# Altium project Forninho.PrjPcb
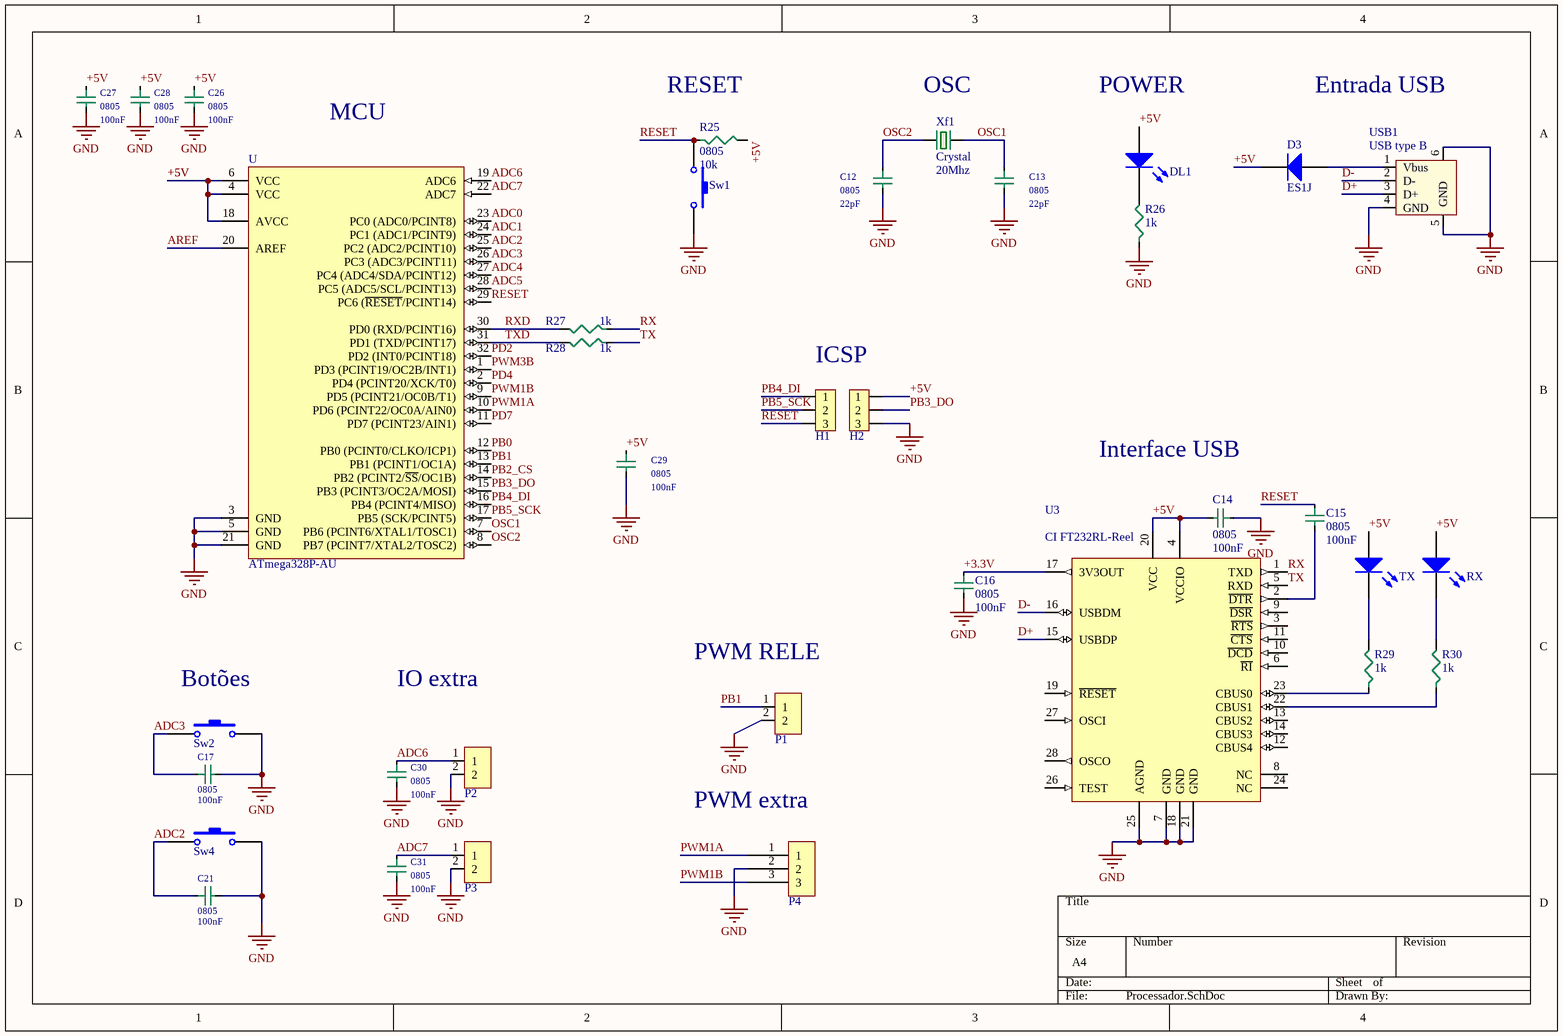
[diagram p0: Processador.SchDoc]
2 sheets, 84 parts. Net scope: global (net labels, ports and power ports of the same name join across sheets).
Board file: PCB.PcbDoc
Sheets:
  Processador.SchDoc
  instrumentacao.SchDoc

## Sheet Processador.SchDoc
size A4

### Parts
(Parts that share a designator on the sheet are numbered #1, #2 ... from top to bottom, then left to right.)
C12  0805  value 22pF  [0805C]
C13  0805  value 22pF  [0805C]
C14  0805  value 100nF  [0805C]
C15  0805  value 100nF  [0805C]
C16  0805  value 100nF  [0805C]
C17  0805  value 100nF  [0805C]
C21  0805  value 100nF  [0805C]
C26  0805  value 100nF  [0805C]
C27  0805  value 100nF  [0805C]
C28  0805  value 100nF  [0805C]
C29  0805  value 100nF  [0805C]
C30  0805  value 100nF  [0805C]
C31  0805  value 100nF  [0805C]
D3  ES1J  [DO-214AC]
DL1  LED 0805  [LED SMD 0805]  (value not drawn)
H1#1  Header 3 pins  [Header 3]  (value not drawn)
H2  Header 3 pins  [Header 3]  (value not drawn)
P1  Molex_2  [Molex_2]  (value not drawn)
P2  Molex_2  [Molex_2]  (value not drawn)
P3  Molex_2  [Molex_2]  (value not drawn)
P4  Molex_3  [Molex_3]  (value not drawn)
R25  0805  value 10k  [0805]
R26  value 1k  [0805]  (hidden comment: 0805)
R27  value 1k  [0805]  (hidden comment: 0805)
R28  value 1k  [0805]  (hidden comment: 0805)
R29  value 1k  [0805]  (hidden comment: 0805)
R30  value 1k  [0805]  (hidden comment: 0805)
RX  LED 0805  [LED SMD 0805]  (value not drawn)
Sw1  SW_PUSH_BUTTON  [PUSH_BUTTON]  (value not drawn)
Sw2  SW_PUSH_BUTTON  [PUSH_BUTTON]  (value not drawn)
Sw4  SW_PUSH_BUTTON  [PUSH_BUTTON]  (value not drawn)
TX  LED 0805  [LED SMD 0805]  (value not drawn)
U  ATmega328P-AU  [32A_N]
U3  CI FT232RL-Reel  [SSOP-28_N]
USB1  USB type B  [USB2.5-2H4D]
Xf1  Crystal  [CRYSTAL HIGH]

### Nets
+5V: C14.2 C26.1 C27.1 C28.1 C29.1 D3.2(K) DL1.1(A) H2.1 R25.2 RX.1(A) TX.1(A) U.4(VCC) U.6(VCC) U.18(AVCC) U3.4(VCCIO) U3.20(VCC)
GND: C12.2 C13.2 C14.1 C16.2 C17.2 C21.2 C26.2 C27.2 C28.2 C29.2 C30.2 C31.2 H2.3 P1.2 P2.2 P3.2 P4.2 R26.1 Sw1.2 Sw2.2 Sw4.2 U.3(GND) U.5(GND) U.21(GND) U3.7(GND) U3.18(GND) U3.21(GND) U3.25(AGND) USB1.4(GND) USB1.5(GND) USB1.6
+3.3V: C16.1 U3.17(3V3OUT)
ADC0: U.23(PC0_(ADC0/PCINT8))
ADC1: U.24(PC1_(ADC1/PCINT9))
ADC2: C21.1 Sw4.1 U.25(PC2_(ADC2/PCINT10))
ADC3: C17.1 Sw2.1 U.26(PC3_(ADC3/PCINT11))
ADC4: U.27(PC4_(ADC4/SDA/PCINT12))
ADC5: U.28(PC5_(ADC5/SCL/PCINT13))
ADC6: C30.1 P2.1 U.19(ADC6)
ADC7: C31.1 P3.1 U.22(ADC7)
AREF: U.20(AREF)
D+: U3.15(USBDP) USB1.3(D+)
D-: U3.16(USBDM) USB1.2(D-)
OSC1: C13.1 U.7(PB6_(PCINT6/XTAL1/TOSC1)) Xf1.1
OSC2: C12.1 U.8(PB7_(PCINT7/XTAL2/TOSC2)) Xf1.2
PB0: U.12(PB0_(PCINT0/CLKO/ICP1))
PB1: P1.1 U.13(PB1_(PCINT1/OC1A))
PB2_CS: U.14(PB2_(PCINT2/~{SS}/OC1B))
PB3_DO: H2.2 U.15(PB3_(PCINT3/OC2A/MOSI))
PB4_DI: H1#1.1 U.16(PB4_(PCINT4/MISO))
PB5_SCK: H1#1.2 U.17(PB5_(SCK/PCINT5))
PD2: U.32(PD2_(INT0/PCINT18))
PD4: U.2(PD4_(PCINT20/XCK/T0))
PD7: U.11(PD7_(PCINT23/AIN1))
PWM1A: P4.1 U.10(PD6_(PCINT22/OC0A/AIN0))
PWM1B: P4.3 U.9(PD5_(PCINT21/OC0B/T1))
PWM3B: U.1(PD3_(PCINT19/OC2B/INT1))
RESET: C15.1 H1#1.3 R25.1 Sw1.1 U.29(PC6_(~{RESET}/PCINT14))
RX: R27.1 U3.1(TXD)
RXD: R27.2 U.30(PD0_(RXD/PCINT16))
TX: R28.1 U3.5(RXD)
TXD: R28.2 U.31(PD1_(TXD/PCINT17))
NetC15_2: C15.2 U3.2(~{DTR})
NetD3_1: D3.1(A) USB1.1(Vbus)
NetDL1_2: DL1.2(K) R26.2
NetR29_1: R29.1 U3.23(CBUS0)
NetR29_2: R29.2 TX.2(K)
NetR30_1: R30.1 U3.22(CBUS1)
NetR30_2: R30.2 RX.2(K)

Not connected (* = marked no-connect by the designer): U3 3(~{RTS}) 6(~{RI}) 8(NC) 9(~{DSR}) 10(~{DCD}) 11(~{CTS}) 12(CBUS4) 13(CBUS2) 14(CBUS3) 19(~{RESET}) 24(NC) 26(TEST) 27(OSCI) 28(OSCO)

### Notes on the sheet
- (near R25) RESET
- (near Xf1) OSC
- POWER
- Entrada USB
- MCU
- ICSP
- Interface USB
- (near Sw2) Botões
- IO extra
- (near P1) PWM RELE
- (near P4) PWM extra
- (in symbol Crystal Oscillator) 20Mhz

### Library data of the parts
C12-C17 C21 C26-C31 = Capacitor SMD 0805
D3 = Diode ES1J: Rectifiers 1.0 A Ultra Fast Recovery Rect; ComponentLink1Description: MOUSER; ComponentLink1URL: https://br.mouser.com/ProductDetail/512-ES1J; ComponentLink2Description: DATASHEET; ComponentLink2URL: https://br.mouser.com/datasheet/2/308/ES1J-D-1804952.pdf
DL1 RX TX = LED 0805 SMD: Typical INFRARED GaAs LED; Published: 8-Jun-2000; LatestRevisionDate: 08-Jul-2005; LatestRevisionNote: Mech Layer 1 removed.; PackageReference: LED-0; Publisher: Altium Limited
H1#1 H2 = Header 1x3 Macho
R25-R30 = Resistor SMD 0805 1/8 W: %: ±1%; P: 1/8W
Sw1 Sw2 Sw4 = SW-PB: Switch Push Button; Published: 24-Mar-1999; LatestRevisionDate: 17-Jul-2002; LatestRevisionNote: Re-released for DXP Platform.; PackageReference: SPST-2; Publisher: Altium Limited
U = ATmega328P-AU: 8-bit AVR Microcontroller, 32KB Flash, 1KB EEPROM, 2KB SRAM, 32-pin TQFP, Industrial Grade (-40°C to 85°C); Published: 1-Apr-2010; DatasheetVersion: revA, Jan-2010; PackageVersion: revB, Oct-2001; PackageReference: 32A; Publisher: Altium Limited; PackageDescription: 32-Lead, 7x7x1.0 mm Body, 0.8mm Lead Pitch, Thin Profile Plastic Quad Flat Package (TQFP); Supplier 1: Digi-Key; Supplier Part Number 1: ATMEGA328P-AU-ND; Supplier 2: Farnell; Supplier Part Number 2: 1715486; Supplier 3: Mouser; Supplier Part Number 3: 556-ATMEGA328P-AU; Code_JEDEC: MS-026-ABA; ComponentLink1Description: Manufacturer Link; ComponentLink1URL: http://www.atmel.com/products/avr/default.asp?; ComponentLink2Description: ATmega48A/48PA/88A/88PA/168A/168PA/328/328P Datasheet; ComponentLink2URL: http://www.atmel.com/dyn/resources/prod_documents/8271.pdf; ComponentLink3Description: ATmega48A/48PA/88A/88PA/168A/168PA/328/328P Summary; ComponentLink3URL: http://www.atmel.com/dyn/resources/prod_documents/8271S.pdf; ComponentLink4Description: Atmel.com Home; ComponentLink4URL: http://www.atmel.com
U3 = CI FT232RL-Reel: USB UART Asynchronous Serial Data Transfer Chip, SSOP-28, Tape and Reel; Published: 19-Aug-2010; DatasheetVersion: ver 2.07, Jul-2010; PackageVersion: 2010; PackageReference: SSOP-28; Publisher: Altium Limited; PackageDescription: 28-Pin Small Outline Package 0.65 mm Pitch; ComponentLink1Description: Manufacturer Link; ComponentLink1URL: http://www.ftdichip.com/Products/ICs/FT232R.htm; ComponentLink2Description: Datasheet; ComponentLink2URL: http://www.ftdichip.com/Support/Documents/DataSheets/ICs/DS_FT232R.pdf
Xf1 = Crystal Oscillator

## Sheet instrumentacao.SchDoc
size A4
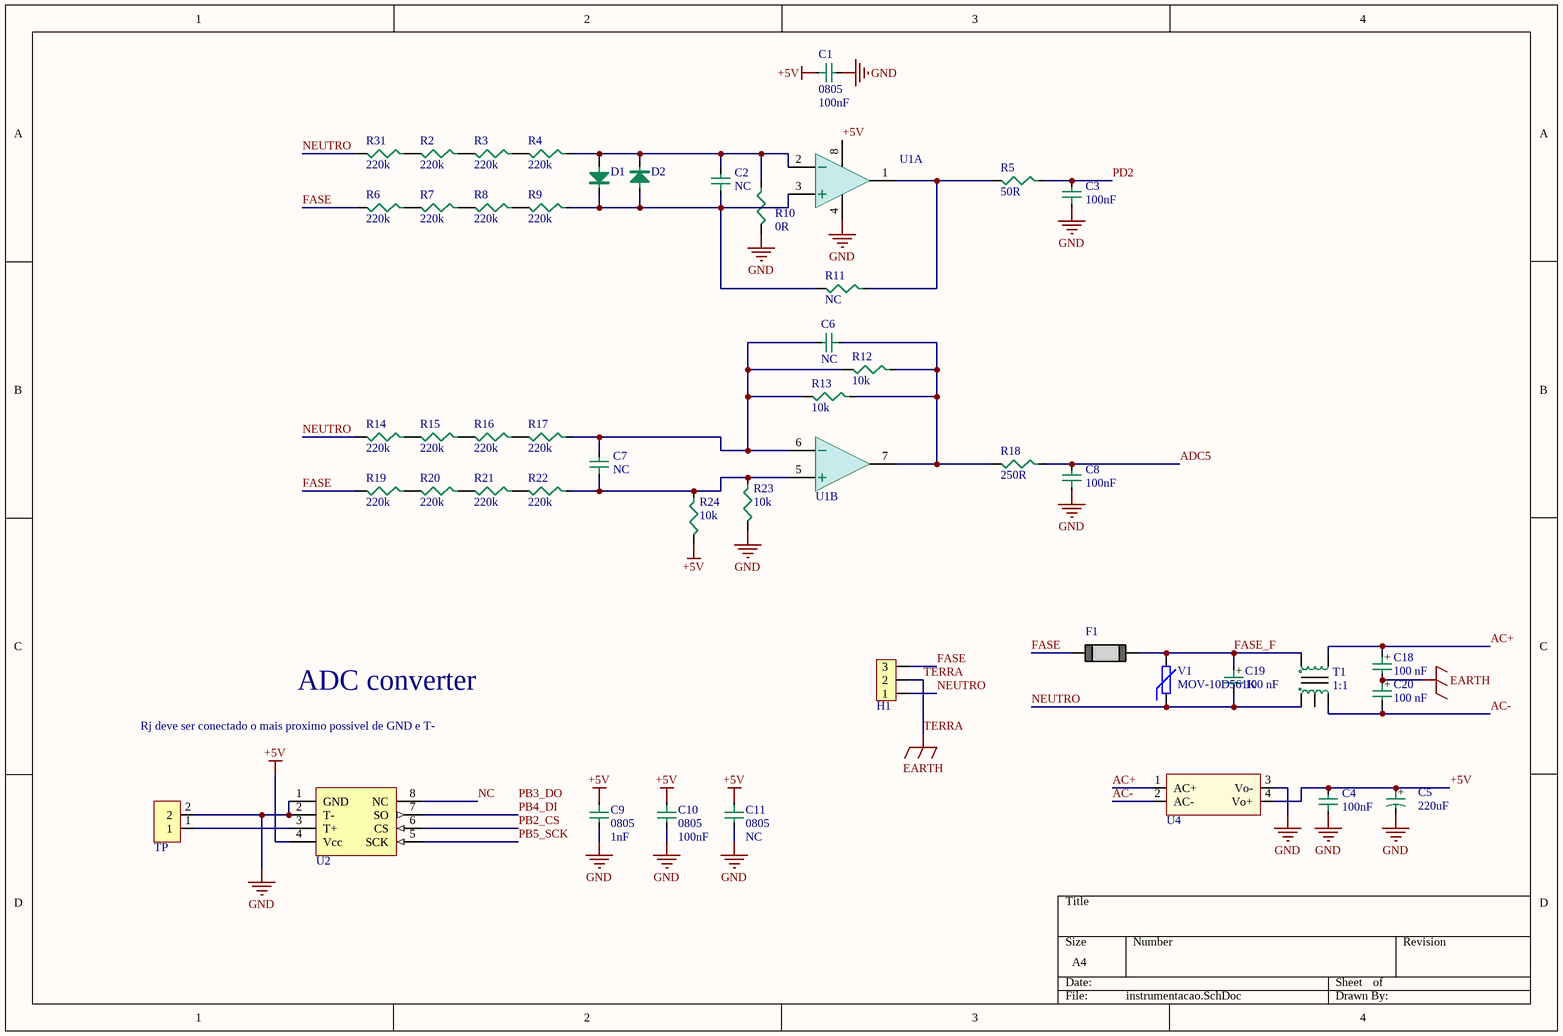
[diagram p1: instrumentacao.SchDoc]

### Parts
(Parts that share a designator on the sheet are numbered #1, #2 ... from top to bottom, then left to right.)
C1  0805  value 100nF  [0805C]
C2  value NC  [0805C]  (hidden comment: 0805)
C3  value 100nF  [0805C]  (hidden comment: 0805)
C4  value 100nF  [0805C]  (hidden comment: 0805)
C5  value 220uF  [CAP SMD D10.0 A10.2]  (hidden comment: D10.0 A10.2)
C6  value NC  [0805C]  (hidden comment: 0805)
C7  value NC  [0805C]  (hidden comment: 0805)
C8  value 100nF  [0805C]  (hidden comment: 0805)
C9  0805  value 1nF  [0805C]
C10  0805  value 100nF  [0805C]
C11  0805  value NC  [0805C]
C18  value 100 nF  [CAP FILM 10 mm Lead]  (hidden comment: Cap Film 22.5mm)
C19  value 100 nF  [CAP FILM 10 mm Lead]  (hidden comment: Cap Film 22.5mm)
C20  value 100 nF  [CAP FILM 10 mm Lead]  (hidden comment: Cap Film 22.5mm)
D1  1N4148 SMD  [DIODE SMD LL-34]  (value not drawn)
D2  1N4148 SMD  [DIODE SMD LL-34]  (value not drawn)
F1  5 x 20 mm  [Fuseholder 5 x 20 mm]  (value not drawn)
H1#2  Terminal Blocks 3 Pos 5.08mm  [BLOCK3P]  (value not drawn)
R2  value 220k  [0805]  (hidden comment: 0805)
R3  value 220k  [0805]  (hidden comment: 0805)
R4  value 220k  [0805]  (hidden comment: 0805)
R5  value 50R  [0805]  (hidden comment: 0805)
R6  value 220k  [0805]  (hidden comment: 0805)
R7  value 220k  [0805]  (hidden comment: 0805)
R8  value 220k  [0805]  (hidden comment: 0805)
R9  value 220k  [0805]  (hidden comment: 0805)
R10  value 0R  [0805]  (hidden comment: 0805)
R11  value NC  [0805]  (hidden comment: 0805)
R12  value 10k  [0805]  (hidden comment: 0805)
R13  value 10k  [0805]  (hidden comment: 0805)
R14  value 220k  [0805]  (hidden comment: 0805)
R15  value 220k  [0805]  (hidden comment: 0805)
R16  value 220k  [0805]  (hidden comment: 0805)
R17  value 220k  [0805]  (hidden comment: 0805)
R18  value 250R  [0805]  (hidden comment: 0805)
R19  value 220k  [0805]  (hidden comment: 0805)
R20  value 220k  [0805]  (hidden comment: 0805)
R21  value 220k  [0805]  (hidden comment: 0805)
R22  value 220k  [0805]  (hidden comment: 0805)
R23  value 10k  [0805]  (hidden comment: 0805)
R24  value 10k  [0805]  (hidden comment: 0805)
R31  value 220k  [0805]  (hidden comment: 0805)
T1  value 1:1  [Trafo_Driver]  (hidden comment: Transformador Driver)
TP  Molex_2  [Molex_2]  (value not drawn)
U1  CI Ampop Soic-8 generico  [SOIC 8]  (value not drawn)  (parts A,B of 2)
U2  MAX6675  [SOIC 8]  (value not drawn)
U4  5V supply*  [HILINK]  (value not drawn)
V1  MOV-10D561K  [VARISTOR 7.5mm]

### Nets
+5V: C1.1 C4.2 C5.1 C9.1 C10.1 C11.1 R24.2 U1.8(V+) U2.4(Vcc) U4.4(Vo+)
GND: C1.2 C3.1 C4.1 C5.2 C8.1 C9.2 C10.2 C11.2 R10.2 R23.2 TP.2 U1.4(V-) U2.1(GND) U2.2(T-) U4.3(Vo-)
TERRA: C18.2 C20.1 H1#2.2  [also labelled EARTH]
AC+: C18.1 T1.2 U4.1(AC+)
AC-: C20.2 T1.5 U4.2(AC-)
ADC5: C8.2 R18.1
FASE: F1.2 H1#2.3 R6.2 R19.2
FASE_F: C19.1 F1.1 T1.1 V1.2
NC: U2.8(NC)
NEUTRO: C19.2 H1#2.1 R14.2 R31.2 T1.3 V1.1
PB2_CS: U2.6(CS)
PB4_DI: U2.7(SO)
PB5_SCK: U2.5(SCK)
PD2: C3.2 R5.1
NetC2_1: C2.1 D1.K D2.A R9.1 R11.2 U1.3
NetC2_2: C2.2 D1.A D2.K R4.1 R10.1 U1.2
NetC6_1: C6.1 R12.1 R13.1 R18.2 U1.7
NetC6_2: C6.2 C7.2 R12.2 R13.2 R17.1 U1.6
NetC7_1: C7.1 R22.1 R23.1 R24.1 U1.5
NetR2_1: R2.1 R3.2
NetR2_2: R2.2 R31.1
NetR3_1: R3.1 R4.2
NetR5_2: R5.2 R11.1 U1.1
NetR6_1: R6.1 R7.2
NetR7_1: R7.1 R8.2
NetR8_1: R8.1 R9.2
NetR14_1: R14.1 R15.2
NetR15_1: R15.1 R16.2
NetR16_1: R16.1 R17.2
NetR19_1: R19.1 R20.2
NetR20_1: R20.1 R21.2
NetR21_1: R21.1 R22.2
NetTP_1: TP.1 U2.3(T+)

Not connected (* = marked no-connect by the designer): T1 4

### Notes on the sheet
- ADC converter
- Rj deve ser conectado o mais proximo possivel de GND e T-
- Labels drawn without touching a wire or pin: PB3_DO
- (in symbol Capacitor FILM 100nF 275 VAc) +
- (in symbol Capacitor SMD D10.0 A10.2) +

### Library data of the parts
C1-C4 C6-C11 = Capacitor SMD 0805
C5 = Capacitor SMD D10.0 A10.2: %: ±20%
C18-C20 = Capacitor FILM 100nF 275 VAc: Safety Capacitors 275VAC 0.1uF 10% LS 10mm X2; %: ±20%; Tensão: 200V; ComponentLink1Description: Mouser; ComponentLink1URL: https://www.mouser.com/ProductDetail/EPCOS-TDK/B32921Y2104K000?qs=TuK3vfAjtkXr4SycMmru8w%3D%3D
D1 D2 = Diodo Sinal SMD 1N4148: Diodo Sinal SMD LL-34
F1 = FuseHolder 5 x 20 mm: Fuseholder Open Design, 5 x 20 mm; Tensão: 500 VA; Corrente: 16A; DataSheet: https://br.mouser.com/datasheet/2/358/typ_OGN-14523.pdf; 3D Model: https://www.3dcontentcentral.com/secure/download-model.aspx?catalogid=171&id=541358
H1#2 = Header  Pos 5.08mm: Pluggable Terminal Blocks 3 Pos 5.08mm pitch Through Hole Header; ComponentLink1Description: mouser; ComponentLink1URL: https://br.mouser.com/ProductDetail/Phoenix-Contact/1757255?qs=uD%2FdkN7XIa0ez8xszzicKg%3D%3D; ComponentLink2Description: datasheet; ComponentLink2URL: https://br.mouser.com/datasheet/2/324/4/1757255-1440716.pdf
R2-R24 R31 = Resistor SMD 0805 1/8 W: %: ±1%; P: 1/8W
U2 = MAX6675: Cold-Junction-Compensated K-Thermocoupleto-Digital Converter (0°C to +1024°C); ComponentLink1Description: Datasheet; ComponentLink1URL: https://datasheets.maximintegrated.com/en/ds/MAX6675.pdf
U4 = HI-LINK PM01 3W: 5V 3W Ultra-small Power Module PM03; ComponentLink1Description: datasheet; ComponentLink1URL: https://datasheet.lcsc.com/szlcsc/1909111105_HI-LINK-HLK-PM24_C399250.pdf
V1 = Varistor: Varistors 180pF 560volts 10%; ComponentLink1Description: MOUSER; ComponentLink1URL: https://www.mouser.com/ProductDetail/Bourns/MOV-10D561K?qs=lgttKnAd%252B2ArrqGQgWwr6w%3D%3D

## Nets that join several sheets
+5V: Processador (16 pins), instrumentacao (10 pins)
GND: Processador (31 pins), instrumentacao (15 pins)
ADC5: Processador (U.28), instrumentacao (C8.2 R18.1)
PB2_CS: Processador (U.14), instrumentacao (U2.6)
PB4_DI: Processador (H1#1.1 U.16), instrumentacao (U2.7)
PB5_SCK: Processador (H1#1.2 U.17), instrumentacao (U2.5)
PD2: Processador (U.32), instrumentacao (C3.2 R5.1)